# Altium project iot-gateway.PrjPcb (part 1 of 2)
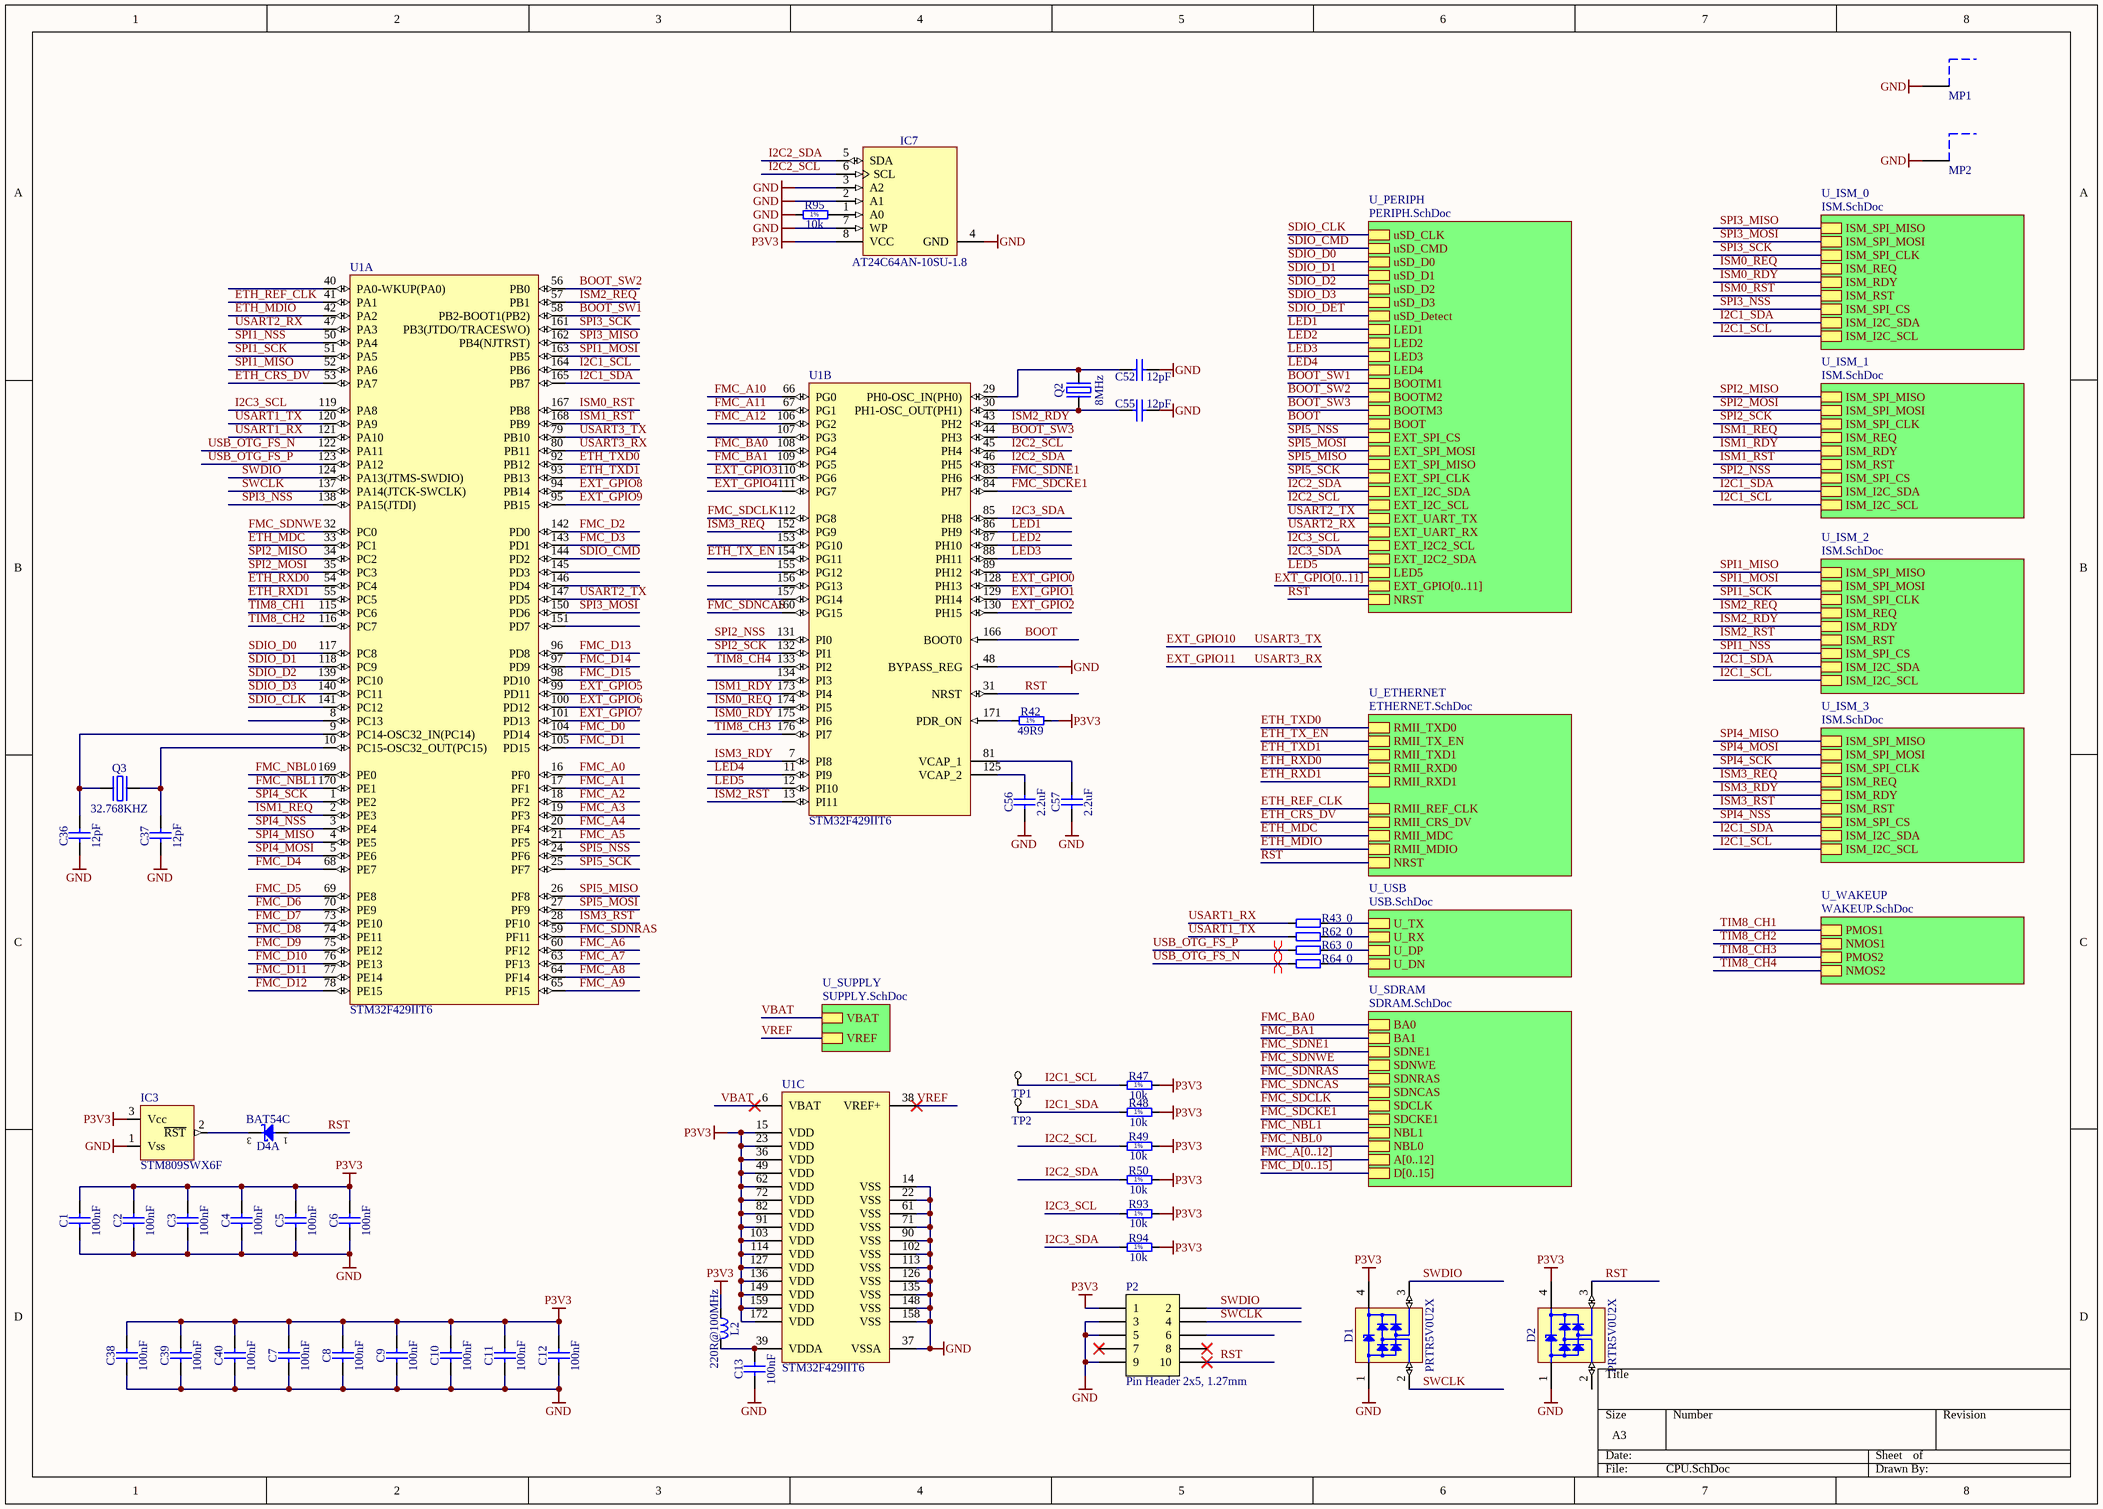
[diagram p0: CPU.SchDoc]
8 sheets, 359 parts. Net scope: hierarchical (ports join the sheet entries above them; power ports are global).
Board files: iot-gateway.PcbDoc, Panel.PcbDoc
Sheets:
  CPU.SchDoc
    U_SDRAM = SDRAM.SchDoc
    U_ETHERNET = ETHERNET.SchDoc
    U_PERIPH = PERIPH.SchDoc
    U_USB = USB.SchDoc
    U_SUPPLY = SUPPLY.SchDoc
    U_ISM_0 = ISM.SchDoc
    U_ISM_1 = ISM.SchDoc
    U_ISM_2 = ISM.SchDoc
    U_ISM_3 = ISM.SchDoc
    U_WAKEUP = WAKEUP.SchDoc

## Sheet CPU.SchDoc
size A3

### Parts
(Parts that share a designator on the sheet are numbered #1, #2 ... from top to bottom, then left to right.)
C1  100nF  [CAPC1005X55N]
C2  100nF  [CAPC1005X55N]
C3  100nF  [CAPC1005X55N]
C4  100nF  [CAPC1005X55N]
C5  100nF  [CAPC1005X55N]
C6  100nF  [CAPC1005X55N]
C7  100nF  [CAPC1005X55N]
C8  100nF  [CAPC1005X55N]
C9  100nF  [CAPC1005X55N]
C10  100nF  [CAPC1005X55N]
C11  100nF  [CAPC1005X55N]
C12  100nF  [CAPC1005X55N]
C13  100nF  [CAPC1005X55N]
C36#1  12pF  [CAPC1005X55N]
C37#1  12pF  [CAPC1005X55N]
C38#1  100nF  [CAPC1005X55N]
C39#1  100nF  [CAPC1005X55N]
C40#1  100nF  [CAPC1005X55N]
C52  12pF  [CAPC1005X55N]
C55  12pF  [CAPC1005X55N]
C56  2.2uF  [CAPC1608X87N]
C57  2.2uF  [CAPC1608X87N]
D1  PRTR5V0U2X  [SOT190P230X110-4N]
D2#1  PRTR5V0U2X  [SOT190P230X110-4N]
D4  BAT54C  [SOT95P240X130-3N]  (part A of 2)
IC3  STM809SWX6F  [SOT95P229X119-3N]
IC7  AT24C64AN-10SU-1.8  [SOIC127P600X175-8N]
L2  220R@100MHz  [INDC2012X105N]
MP1  36103205S  [36103205S]  (value not drawn)
MP2  36103205S  [36103205S]  (value not drawn)
P2  Pin Header 2x5, 1.27mm  [HDR_2x5-SMD-1.27mm-K]
Q2  8MHz  [XTAL_TXC_7A]
Q3  32.768KHZ  [XTAL_ABRACON_ABS09]
R42  49R9  [RESC1005X40N]
R43  0  [RESC1005X40N]
R47  10k  [RESC1005X40N]
R48  10k  [RESC1005X40N]
R49  10k  [RESC1005X40N]
R50  10k  [RESC1005X40N]
R62  0  [RESC1005X40N]
R63  0  [RESC1005X40N]
R64  0  [RESC1005X40N]
R93  10k  [RESC1005X40N]
R94  10k  [RESC1005X40N]
R95  10k  [RESC1005X40N]
TP1#1  TP  [TP]  (value not drawn)  (no BOM)
TP2#1  TP  [TP]  (value not drawn)  (no BOM)
U1  STM32F429IIT6  [STM-LQFP176_N]  (parts A,B,C of 3)

### Sub-sheets
U_ETHERNET = ETHERNET.SchDoc: RMII_TXD0, RMII_TX_EN, RMII_TXD1, RMII_RXD0, RMII_RXD1, RMII_REF_CLK, RMII_CRS_DV, RMII_MDC, RMII_MDIO, NRST
U_ISM_0 = ISM.SchDoc: ISM_SPI_MISO, ISM_SPI_MOSI, ISM_SPI_CLK, ISM_REQ, ISM_RDY, ISM_RST, ISM_SPI_CS, ISM_I2C_SDA, ISM_I2C_SCL
U_ISM_1 = ISM.SchDoc: ISM_SPI_MISO, ISM_SPI_MOSI, ISM_SPI_CLK, ISM_REQ, ISM_RDY, ISM_RST, ISM_SPI_CS, ISM_I2C_SDA, ISM_I2C_SCL
U_ISM_2 = ISM.SchDoc: ISM_SPI_MISO, ISM_SPI_MOSI, ISM_SPI_CLK, ISM_REQ, ISM_RDY, ISM_RST, ISM_SPI_CS, ISM_I2C_SDA, ISM_I2C_SCL
U_ISM_3 = ISM.SchDoc: ISM_SPI_MISO, ISM_SPI_MOSI, ISM_SPI_CLK, ISM_REQ, ISM_RDY, ISM_RST, ISM_SPI_CS, ISM_I2C_SDA, ISM_I2C_SCL
U_PERIPH = PERIPH.SchDoc: uSD_CLK, uSD_CMD, uSD_D0, uSD_D1, uSD_D2, uSD_D3, uSD_Detect, LED1, LED2, LED3, LED4, BOOTM1, BOOTM2, BOOTM3, BOOT, EXT_SPI_CS, EXT_SPI_MOSI, EXT_SPI_MISO, EXT_SPI_CLK, EXT_I2C_SDA, EXT_I2C_SCL, EXT_UART_TX, EXT_UART_RX, LED5, EXT_GPIO[0..11], EXT_I2C2_SCL, EXT_I2C2_SDA, NRST
U_SDRAM = SDRAM.SchDoc: BA0, BA1, SDNE1, SDNWE, SDNRAS, SDNCAS, SDCLK, SDCKE1, NBL1, NBL0, A[0..12], D[0..15]
U_SUPPLY = SUPPLY.SchDoc: VBAT, VREF
U_USB = USB.SchDoc: U_TX, U_RX, U_DP, U_DN
U_WAKEUP = WAKEUP.SchDoc: PMOS1, NMOS1, PMOS2, NMOS2

### Nets
GND: C1.1 C2.1 C3.1 C4.1 C5.1 C6.1 C7.1 C8.1 C9.1 C10.1 C11.1 C12.1 C13.1 C36#1.1 C37#1.1 C38#1.1 C39#1.1 C40#1.1 C52.1 C55.1 C56.1 C57.1 D1.1(GND) D2#1.1(GND) IC3.1(Vss) IC7.2(A1) IC7.3(A2) IC7.4(GND) IC7.7(WP) MP1.1 MP2.1 P2.3 P2.5 P2.9 R95.1 U1.14(VSS) U1.22(VSS) U1.37(VSSA) U1.48(BYPASS_REG) U1.61(VSS) U1.71(VSS) U1.90(VSS) U1.102(VSS) U1.113(VSS) U1.126(VSS) U1.135(VSS) U1.148(VSS) U1.158(VSS)
P3V3: C1.2 C2.2 C3.2 C4.2 C5.2 C6.2 C7.2 C8.2 C9.2 C10.2 C11.2 C12.2 C38#1.2 C39#1.2 C40#1.2 D1.4(VCC) D2#1.4(VCC) IC3.3(Vcc) IC7.8(VCC) L2.1 P2.1 R42.2 R47.2 R48.2 R49.2 R50.2 R93.2 R94.2 U1.15(VDD) U1.23(VDD) U1.36(VDD) U1.49(VDD) U1.62(VDD) U1.72(VDD) U1.82(VDD) U1.91(VDD) U1.103(VDD) U1.114(VDD) U1.127(VDD) U1.136(VDD) U1.149(VDD) U1.159(VDD) U1.172(VDD)
VREF: U1.38(VREF+) ; sheet U_SUPPLY/VREF
BOOT: U1.166(BOOT0) ; sheet U_PERIPH/BOOT
BOOT_SW1: U1.58(PB2-BOOT1(PB2)) ; sheet U_PERIPH/BOOTM1
BOOT_SW2: U1.56(PB0) ; sheet U_PERIPH/BOOTM2
BOOT_SW3: U1.44(PH3) ; sheet U_PERIPH/BOOTM3
ETH_CRS_DV: U1.53(PA7) ; sheet U_ETHERNET/RMII_CRS_DV
ETH_MDC: U1.33(PC1) ; sheet U_ETHERNET/RMII_MDC
ETH_MDIO: U1.42(PA2) ; sheet U_ETHERNET/RMII_MDIO
ETH_REF_CLK: U1.41(PA1) ; sheet U_ETHERNET/RMII_REF_CLK
ETH_RXD0: U1.54(PC4) ; sheet U_ETHERNET/RMII_RXD0
ETH_RXD1: U1.55(PC5) ; sheet U_ETHERNET/RMII_RXD1
ETH_TX_EN: U1.154(PG11) ; sheet U_ETHERNET/RMII_TX_EN
ETH_TXD0: U1.92(PB12) ; sheet U_ETHERNET/RMII_TXD0
ETH_TXD1: U1.93(PB13) ; sheet U_ETHERNET/RMII_TXD1
EXT_GPIO0: U1.128(PH13)
EXT_GPIO1: U1.129(PH14)
EXT_GPIO2: U1.130(PH15)
EXT_GPIO3: U1.110(PG6)
EXT_GPIO4: U1.111(PG7)
EXT_GPIO5: U1.99(PD11)
EXT_GPIO6: U1.100(PD12)
EXT_GPIO7: U1.101(PD13)
EXT_GPIO8: U1.94(PB14)
EXT_GPIO9: U1.95(PB15)
EXT_GPIO10: U1.79(PB10)  [also labelled USART3_TX]
EXT_GPIO11: U1.80(PB11)  [also labelled USART3_RX]
FMC_A0: U1.16(PF0)  [project net A0]
FMC_A1: U1.17(PF1)  [project net A1]
FMC_A2: U1.18(PF2)  [project net A2]
FMC_A3: U1.19(PF3)  [project net A3]
FMC_A4: U1.20(PF4)  [project net A4]
FMC_A5: U1.21(PF5)  [project net A5]
FMC_A6: U1.60(PF12)  [project net A6]
FMC_A7: U1.63(PF13)  [project net A7]
FMC_A8: U1.64(PF14)  [project net A8]
FMC_A9: U1.65(PF15)  [project net A9]
FMC_A10: U1.66(PG0)  [project net A10]
FMC_A11: U1.67(PG1)  [project net A11]
FMC_A12: U1.106(PG2)  [project net A12]
FMC_BA0: U1.108(PG4) ; sheet U_SDRAM/BA0
FMC_BA1: U1.109(PG5) ; sheet U_SDRAM/BA1
FMC_D0: U1.104(PD14)  [project net D0]
FMC_D1: U1.105(PD15)  [project net D1]
FMC_D2: U1.142(PD0)  [project net D2]
FMC_D3: U1.143(PD1)  [project net D3]
FMC_D4: U1.68(PE7)  [project net D4]
FMC_D5: U1.69(PE8)  [project net D5]
FMC_D6: U1.70(PE9)  [project net D6]
FMC_D7: U1.73(PE10)  [project net D7]
FMC_D8: U1.74(PE11)  [project net D8]
FMC_D9: U1.75(PE12)  [project net D9]
FMC_D10: U1.76(PE13)  [project net D10]
FMC_D11: U1.77(PE14)  [project net D11]
FMC_D12: U1.78(PE15)  [project net D12]
FMC_D13: U1.96(PD8)  [project net D13]
FMC_D14: U1.97(PD9)  [project net D14]
FMC_D15: U1.98(PD10)  [project net D15]
FMC_NBL0: U1.169(PE0) ; sheet U_SDRAM/NBL0
FMC_NBL1: U1.170(PE1) ; sheet U_SDRAM/NBL1
FMC_SDCKE1: U1.84(PH7) ; sheet U_SDRAM/SDCKE1
FMC_SDCLK: U1.112(PG8) ; sheet U_SDRAM/SDCLK
FMC_SDNCAS: U1.160(PG15) ; sheet U_SDRAM/SDNCAS
FMC_SDNE1: U1.83(PH6) ; sheet U_SDRAM/SDNE1
FMC_SDNRAS: U1.59(PF11) ; sheet U_SDRAM/SDNRAS
FMC_SDNWE: U1.32(PC0) ; sheet U_SDRAM/SDNWE
I2C1_SCL: R47.1 TP1#1.1 U1.164(PB6) ; sheet U_ISM_0/ISM_I2C_SCL, sheet U_ISM_1/ISM_I2C_SCL, sheet U_ISM_2/ISM_I2C_SCL, sheet U_ISM_3/ISM_I2C_SCL
I2C1_SDA: R48.1 TP2#1.1 U1.165(PB7) ; sheet U_ISM_0/ISM_I2C_SDA, sheet U_ISM_1/ISM_I2C_SDA, sheet U_ISM_2/ISM_I2C_SDA, sheet U_ISM_3/ISM_I2C_SDA
I2C2_SCL: IC7.6(SCL) R49.1 U1.45(PH4) ; sheet U_PERIPH/EXT_I2C_SCL
I2C2_SDA: IC7.5(SDA) R50.1 U1.46(PH5) ; sheet U_PERIPH/EXT_I2C_SDA
I2C3_SCL: R93.1 U1.119(PA8) ; sheet U_PERIPH/EXT_I2C2_SCL
I2C3_SDA: R94.1 U1.85(PH8) ; sheet U_PERIPH/EXT_I2C2_SDA
ISM0_RDY: U1.175(PI6) ; sheet U_ISM_0/ISM_RDY
ISM0_REQ: U1.174(PI5) ; sheet U_ISM_0/ISM_REQ
ISM0_RST: U1.167(PB8) ; sheet U_ISM_0/ISM_RST
ISM1_RDY: U1.173(PI4) ; sheet U_ISM_1/ISM_RDY
ISM1_REQ: U1.2(PE3) ; sheet U_ISM_1/ISM_REQ
ISM1_RST: U1.168(PB9) ; sheet U_ISM_1/ISM_RST
ISM2_RDY: U1.43(PH2) ; sheet U_ISM_2/ISM_RDY
ISM2_REQ: U1.57(PB1) ; sheet U_ISM_2/ISM_REQ
ISM2_RST: U1.13(PI11) ; sheet U_ISM_2/ISM_RST
ISM3_RDY: U1.7(PI8) ; sheet U_ISM_3/ISM_RDY
ISM3_REQ: U1.152(PG9) ; sheet U_ISM_3/ISM_REQ
ISM3_RST: U1.28(PF10) ; sheet U_ISM_3/ISM_RST
LED1: U1.86(PH9) ; sheet U_PERIPH/LED1
LED2: U1.87(PH10) ; sheet U_PERIPH/LED2
LED3: U1.88(PH11) ; sheet U_PERIPH/LED3
LED4: U1.11(PI9) ; sheet U_PERIPH/LED4
LED5: U1.12(PI10) ; sheet U_PERIPH/LED5
RST: D2#1.3(I/O2) D4.1(A) P2.10 U1.31(NRST) ; sheet U_ETHERNET/NRST, sheet U_PERIPH/NRST
SDIO_CLK: U1.141(PC12) ; sheet U_PERIPH/uSD_CLK
SDIO_CMD: U1.144(PD2) ; sheet U_PERIPH/uSD_CMD
SDIO_D0: U1.117(PC8) ; sheet U_PERIPH/uSD_D0
SDIO_D1: U1.118(PC9) ; sheet U_PERIPH/uSD_D1
SDIO_D2: U1.139(PC10) ; sheet U_PERIPH/uSD_D2
SDIO_D3: U1.140(PC11) ; sheet U_PERIPH/uSD_D3
SPI1_MISO: U1.52(PA6) ; sheet U_ISM_2/ISM_SPI_MISO
SPI1_MOSI: U1.163(PB5) ; sheet U_ISM_2/ISM_SPI_MOSI
SPI1_NSS: U1.50(PA4) ; sheet U_ISM_2/ISM_SPI_CS
SPI1_SCK: U1.51(PA5) ; sheet U_ISM_2/ISM_SPI_CLK
SPI2_MISO: U1.34(PC2) ; sheet U_ISM_1/ISM_SPI_MISO
SPI2_MOSI: U1.35(PC3) ; sheet U_ISM_1/ISM_SPI_MOSI
SPI2_NSS: U1.131(PI0) ; sheet U_ISM_1/ISM_SPI_CS
SPI2_SCK: U1.132(PI1) ; sheet U_ISM_1/ISM_SPI_CLK
SPI3_MISO: U1.162(PB4(NJTRST)) ; sheet U_ISM_0/ISM_SPI_MISO
SPI3_MOSI: U1.150(PD6) ; sheet U_ISM_0/ISM_SPI_MOSI
SPI3_NSS: U1.138(PA15(JTDI)) ; sheet U_ISM_0/ISM_SPI_CS
SPI3_SCK: U1.161(PB3(JTDO/TRACESWO)) ; sheet U_ISM_0/ISM_SPI_CLK
SPI4_MISO: U1.4(PE5) ; sheet U_ISM_3/ISM_SPI_MISO
SPI4_MOSI: U1.5(PE6) ; sheet U_ISM_3/ISM_SPI_MOSI
SPI4_NSS: U1.3(PE4) ; sheet U_ISM_3/ISM_SPI_CS
SPI4_SCK: U1.1(PE2) ; sheet U_ISM_3/ISM_SPI_CLK
SPI5_MISO: U1.26(PF8) ; sheet U_PERIPH/EXT_SPI_MISO
SPI5_MOSI: U1.27(PF9) ; sheet U_PERIPH/EXT_SPI_MOSI
SPI5_NSS: U1.24(PF6) ; sheet U_PERIPH/EXT_SPI_CS
SPI5_SCK: U1.25(PF7) ; sheet U_PERIPH/EXT_SPI_CLK
SWCLK: D1.2(I/O1) P2.4 U1.137(PA14(JTCK-SWCLK))
SWDIO: D1.3(I/O2) P2.2 U1.124(PA13(JTMS-SWDIO))
TIM8_CH1: U1.115(PC6) ; sheet U_WAKEUP/PMOS1
TIM8_CH2: U1.116(PC7) ; sheet U_WAKEUP/NMOS1
TIM8_CH3: U1.176(PI7) ; sheet U_WAKEUP/PMOS2
TIM8_CH4: U1.133(PI2) ; sheet U_WAKEUP/NMOS2
U_N: R64.1 ; sheet U_USB/U_DN
U_P: R63.2 ; sheet U_USB/U_DP
USART1_RX: R43.1 U1.121(PA10)
USART1_TX: R62.2 U1.120(PA9)
USART2_RX: U1.47(PA3) ; sheet U_PERIPH/EXT_UART_RX
USART2_TX: U1.147(PD5) ; sheet U_PERIPH/EXT_UART_TX
USB_OTG_FS_N: R64.2 U1.122(PA11)
USB_OTG_FS_P: R63.1 U1.123(PA12)
VBAT: U1.6(VBAT) ; sheet U_SUPPLY/VBAT
NetC13_2: C13.2 L2.2 U1.39(VDDA)
NetC36#1_2: C36#1.2 Q3.1(OSC1) U1.9(PC14-OSC32_IN(PC14))
NetC37#1_2: C37#1.2 Q3.2(OSC2) U1.10(PC15-OSC32_OUT(PC15))
NetC52_2: C52.2 Q2.2(OSC2) U1.29(PH0-OSC_IN(PH0))
NetC55_2: C55.2 Q2.1(OSC1) U1.30(PH1-OSC_OUT(PH1))
NetC56_2: C56.2 U1.125(VCAP_2)
NetC57_2: C57.2 U1.81(VCAP_1)
NetD4_3: D4.3(COMC) IC3.2(~{RST})
NetIC7_1: IC7.1(A0) R95.2
NetR42_1: R42.1 U1.171(PDR_ON)
NetR43_2: R43.2 ; sheet U_USB/U_TX
NetR62_1: R62.1 ; sheet U_USB/U_RX

Not connected (* = marked no-connect by the designer): D2#1 2(I/O1); P2 6 7* 8*; U1 8(PC13) 40(PA0-WKUP(PA0)) 89(PH12) 107(PG3) 134(PI3) 145(PD3) 146(PD4) 151(PD7) 153(PG10) 155(PG12) 156(PG13) 157(PG14)

### Buses and harness runs
bus EXT_GPIO[0..11] = sheet U_PERIPH/EXT_GPIO[0..11]
bus FMC_A[0..12] = sheet U_SDRAM/A[0..12]
bus FMC_D[0..15] = sheet U_SDRAM/D[0..15]

### Layout directives
differential pair: USB_OTG_FS_N, USB_OTG_FS_P

### Notes on the sheet
- (in symbol R0402_10K_1%_0.0625W_100PPM) 1%
- (in symbol R0402_49R9_1%_0.0625W_100PPM) 1%

### Library data of the parts
C1-C13 C38#1 C39#1 C40#1 = CC0402_100NF_16V_10%_X5R: Non-polarised capacitor; Part Description: SMD Multilayer Chip Ceramic Capacitor; Manufacturer: GENERIC; Manufacturer1 Part Number: GRM155R61C104KA88D; Voltage: 16V; TC: X5R; Tolerance: ±10%; Part Number: CC0402_100NF_16V_10%_X5R; Component Kind: Standard; Component Type: Standard; Pin Count: 2; Value: 100nF; Status: None; Manufacturer Part Number: CC0402_100NF_16V_10%_X5R; Case: 0402; Mounted: Yes; Socket: No; SMD: Yes; Sense: No; Manufacturer1 Example: MURATA; Manufacturer1 ComponentHeight: 0.55mm; HelpURL: \\cern.ch\dfs\Applications\Altium\Datasheets\CC0402_X5R_MURATA_GRM.pdf; Author: CERN DEM JLC; CreateDate: 2013-12-10; LatestRevisionDate: 2013-12-10
C36#1 C37#1 C52 C55 = CC0402_12PF_50V_5%_C0G: Non-polarised capacitor; Part Description: SMD Multilayer Chip Ceramic Capacitor; Manufacturer: GENERIC; Manufacturer1 Part Number: C0402C120J5GACTU; Voltage: 50V; TC: C0G/NP0; Tolerance: ±5%; Part Number: CC0402_12PF_50V_5%_C0G; Component Kind: Standard; Component Type: Standard; Pin Count: 2; Value: 12pF; Status: Preferred; Manufacturer Part Number: CC0402_12PF_50V_5%_C0G; Case: 0402; Mounted: Yes; Socket: No; SMD: Yes; Sense: No; Manufacturer1 Example: KEMET; Manufacturer1 ComponentHeight: 0.55mm; HelpURL: \\cern.ch\dfs\Applications\Altium\Datasheets\CC0805_C0G_KEMET_(Commercial Grade).pdf; Author: CERN DEM JLC; CreateDate: 2016-10-04; LatestRevisionDate: 2016-10-04
C56 C57 = CC0603_2.2UF_16V_10%_X5R: Non-polarised capacitor; Part Description: SMD Multilayer Chip Ceramic Capacitor; Manufacturer: GENERIC; Manufacturer1 Part Number: CC0603KRX5R7BB225; Voltage: 16V; TC: X5R; Tolerance: ±10%; Part Number: CC0603_2.2UF_16V_10%_X5R; Component Kind: Standard; Component Type: Standard; Pin Count: 2; Value: 2.2uF; Status: Preferred; Manufacturer Part Number: CC0603_2.2UF_16V_10%_X5R; Case: 0603; Mounted: Yes; Socket: No; SMD: Yes; Sense: No; Manufacturer1 Example: YAGEO; Manufacturer1 ComponentHeight: 0.9mm; HelpURL: \\cern.ch\dfs\Applications\Altium\Datasheets\CC0805_X5R_PHYCOMP_HC.pdf; Author: CERN DEM JLC; CreateDate: 2011-04-28; LatestRevisionDate: 2011-04-28
D1 D2#1 = PRTR5V0U2X: Ultra Low Capacitance Double Rail-to-Rail ESD Protection Diode; Part Description: Ultra Low Capacitance (1pF) Double Rail-to-Rail ESD Protection Diode (8kV); Manufacturer: NXP SEMICONDUCTORS; Voltage: 5.5V; PressFit: No; Bonding: No; Part Number: PRTR5V0U2X; Component Kind: Standard; Component Type: Standard; Device: PRTR5V0U2X; PackageDescription: SOT143B, SOT, 1.90mm Pitch; 4 Pin, 1.30mm W X 2.90mm L X 1.10mm H body, IPC Medium Density; Manufacturer Part Number: PRTR5V0U2X; Pin Count: 4; Case: SOT143B; Mounted: Yes; Socket: No; SMD: Yes; Sense: No; ComponentHeight: 1.1mm; HelpURL: \\cern.ch\dfs\Applications\Altium\Datasheets\PRTR5V0U2X.pdf; Author: CERN DEM JLC; CreateDate: 22.03.2011; LatestRevisionDate: 22.03.2011
D4 = BAT54C: Dual Common Cathode Schottky Diodes; Part Description: Dual Common Cathode Small Signal Schottky Diode; Manufacturer: FAIRCHILD SEMICONDUCTOR; Voltage: 30V; Power: 200mA; PressFit: No; Bonding: No; Part Number: BAT54C; Component Kind: Standard; Component Type: Standard; Device: BAT54C; PackageDescription: SOT23 3-Leads, Pitch 0.95mm - Body 1.3x2.9mm, IPC Medium Density; Manufacturer Part Number: BAT54C; Pin Count: 3; Case: SOT23-3; Mounted: Yes; Socket: No; SMD: Yes; Sense: No; ComponentHeight: 1.30mm; HelpURL: \\cern.ch\dfs\Applications\Altium\Datasheets\BAT54C.pdf; Author: CERN DEM JLC; CreateDate: 2009-09-17; LatestRevisionDate: 2010-05-27
IC3 = VMON_STM809: 2.93V  Reset circuit
IC7 = AT24C64AN-10SU-1.8: 64K (8192 x 8), Two-Wire Serial EEPROM; Part Description: 1.8V, 64K (8192 x 8), Two-Wire Serial EEPROM; Manufacturer: ATMEL; PressFit: No; Bonding: No; Part Number: AT24C64AN-10SU-1.8; Component Kind: Standard; Component Type: Standard; Device: AT24C64AN-10SU-1.8; PackageDescription: SOIC 8, Pitch 1.27mm - Body 4x5mm, IPC Medium Density; Status: Obsolete; Manufacturer Part Number: AT24C64AN-10SU-1.8; Pin Count: 8; Case: SOIC8; Mounted: Yes; Socket: No; SMD: Yes; Sense: No; ComponentHeight: 1.75mm; HelpURL: \\cern.ch\dfs\Applications\Altium\Datasheets\AT24C64AN-10SU-1.8.pdf; Author: CERN DEM JLC; CreateDate: 2013-11-26; LatestRevisionDate: 2013-11-26
L2 = IND0805_MURATA_BLM21PG221SN1D: Inductor; Part Description: SMD EMIFIL Suppression Chip Ferrite Bead; Manufacturer: MURATA; Power: 2A; Resistance: 0.05R; Tolerance: ±25%; Part Number: IND0805_MURATA_BLM21PG221SN1D; Component Kind: Standard; Component Type: Standard; Pin Count: 2; Value: 220R@100MHz; Status: None; Manufacturer Part Number: BLM21PG221SN1D; Case: 0805; Mounted: Yes; Socket: No; SMD: Yes; Sense: No; ComponentHeight: 1.05mm; HelpURL: \\cern.ch\dfs\Applications\Altium\Datasheets\IND0402_MURATA_BLM21P.pdf; Author: CERN DEM JLC; CreateDate: 2010-01-25; LatestRevisionDate: 2010-01-25
MP1 MP2 = 36103205S: WE-SHC Shielding Cabinet, SMD Frame, 20 x 20 x 3 mm; Published Date: April 2017; Publisher: Wurth Elektronik; ComponentLink1Description: Manufacturer; ComponentLink1URL: http://www.we-online.de; ComponentLink2Description: Datasheet; ComponentLink2URL: http://katalog.we-online.de/pbs/datasheet/36103205S.pdf; Part Number: 36103205S; Type: SMD Frame; Size: 20 x 20 x 3 mm
P2 = Pin Header 2x5 SMD, 1.27mm, KS: Pin Header 2x5, 1.27mm (50mil), SMD, Keying Shroud; Manufacturer: WCON; Manufacturer Part Number: 3132-10MS0BK00R1; 2nd source part number: FTSH-105-01-F-DV-K; Artikkelnr Noca: 55010009; Artikkelnr Simpro: N.A.; Part Number: Pin Header 2x5 SMD, 1.27mm, KS; Datasheet: \\hizz\pro\app9717\Datasheet\connectores\W-CON\3132-XXMXXBK00XX.pdf; Footprint Doc: HDR_2x5-SMD-1.27mm; LatestRevisionDate: 2016-04-21; Pin Count: 10; Publisher: Nordic Semiconductor; Published: 2016-01-22; Value: Pin Header 2x5, 1.27mm; Note: *; Supplier: Cabcon; Supplier part number: 3132-10MS0BK00R1; 2nd source Supplier: Samtec
Q2 = XTAL_8MHZ_TXC_7A-8.000MAAE-T: Quartz Crystal; Part Description: Tolerance: ±30ppm, Stability: ±30ppm, -20°C to +70°C, 12pF, SMD Glass Seam Sealing Crystal, 7A Series; Manufacturer: TXC CORPORATION; PressFit: No; Bonding: No; Part Number: XTAL_8MHZ_TXC_7A-8.000MAAE-T; Component Kind: Standard; Component Type: Standard; PackageDescription: 2 Pins, 3.2x5mm, SMD Glass Seam Sealing Crystal, 7A Serie; Value: 8MHz; Manufacturer Part Number: 7A-8.000MAAE-T; Pin Count: 2; Mounted: Yes; Socket: No; SMD: Yes; Sense: No; ComponentHeight: 1.2mm; HelpURL: \\cern.ch\dfs\Applications\Altium\Datasheets\XTAL_TXC_7A.pdf; Author: CERN DEM JLC; CreateDate: 09.10.2014; LatestRevisionDate: 12.11.2014
Q3 = XTAL_32.768KHZ_ABRACON_ABS09-32.768KHZ-T: Quartz Crystal; Part Description: Tolerance: ±20ppm, Stability: ±5ppm, -40°C to +85°C, 12.5pF, SMD Low Profile Crystal, ABS09 Series; PressFit: No; Bonding: No; Part Number: XTAL_32.768KHZ_ABRACON_ABS09-32.768KHZ-T; Component Kind: Standard; Component Type: Standard; PackageDescription: 2 Pins, 4.1x1.5mm, SMD Low Profile Crystal, ABS09 Serie; Value: 32.768KHZ; Manufacturer: ABRACON; Manufacturer Part Number: ABS09-32.768KHZ-T; Pin Count: 2; Mounted: Yes; Socket: No; SMD: Yes; Sense: No; ComponentHeight: 0.9mm; HelpURL: \\cern.ch\dfs\Applications\Altium\Datasheets\XTAL_ABRACON_ABS09.pdf; Author: CERN DEM JLC; CreateDate: 2014-10-16; LatestRevisionDate: 2014-10-16
R42 = R0402_49R9_1%_0.0625W_100PPM: Resistor - 1%; Part Description: General Purpose Thick Film Chip Resistor; Manufacturer: GENERIC; Manufacturer1 Part Number: 232270674999L or RC0402FR-0749R9L; TC: ±100ppm/°C; Part Number: R0402_49R9_1%_0.0625W_100PPM; Component Kind: Standard; Component Type: Standard; Pin Count: 2; Value: 49R9; Status: Not recommended; Power: 0.0625W; Tolerance: ±1%; Manufacturer Part Number: R0402_49R9_1%_0.0625W_100PPM; Case: 0402; Mounted: Yes; Sense: No; Socket: No; SMD: Yes; Manufacturer1 Example: YAGEO PHYCOMP; Manufacturer1 ComponentHeight: 0.4mm; HelpURL: \\cern.ch\dfs\Applications\Altium\Datasheets\R0402_Phycomp_RC0402.pdf; Author: CERN DEM JLC; CreateDate: 2012-10-24; LatestRevisionDate: 2012-10-24
R43 R62-R64 = R0402_0R_JUMPER: Resistor; Part Description: 1A (0.05R Max DC Resistance) Zero Ohm Jumper; Manufacturer: GENERIC; Manufacturer1 Part Number: 232270591001L; Part Number: R0402_0R_JUMPER; Component Kind: Standard; Component Type: Standard; Pin Count: 2; Value: 0; Status: Not recommended; Manufacturer Part Number: R0402_0R_JUMPER; Case: 0402; Mounted: Yes; Sense: No; Socket: No; SMD: Yes; Manufacturer1 Example: YAGEO PHYCOMP; Manufacturer1 ComponentHeight: 0.4mm; HelpURL: \\cern.ch\dfs\Applications\Altium\Datasheets\R0402_Phycomp_RC0402.pdf; Author: CERN DEM JLC; CreateDate: 2007-12-03; LatestRevisionDate: 2012-10-17
R47-R50 R93-R95 = R0402_10K_1%_0.0625W_100PPM: Resistor - 1%; Part Description: General Purpose Thick Film Chip Resistor; Manufacturer: GENERIC; Manufacturer1 Part Number: 232270671003L; TC: ±100ppm/°C; Part Number: R0402_10K_1%_0.0625W_100PPM; Component Kind: Standard; Component Type: Standard; Pin Count: 2; Value: 10k; Status: Not recommended; Power: 0.0625W; Tolerance: ±1%; Manufacturer Part Number: R0402_10K_1%_0.0625W_100PPM; Case: 0402; Mounted: Yes; Sense: No; Socket: No; SMD: Yes; Manufacturer1 Example: YAGEO PHYCOMP; Manufacturer1 ComponentHeight: 0.4mm; HelpURL: \\cern.ch\dfs\Applications\Altium\Datasheets\R0402_Phycomp_RC0402.pdf; Author: CERN DEM JLC; CreateDate: 2007-12-03; LatestRevisionDate: 2012-10-17
TP1#1 TP2#1 = TP: Testpoint
U1 = STM32F429IIT6: ARM Cortex-M4 32-bit MCU+FPU, 225 DMIPS, 2048 kB Flash, 256 kB Internal RAM, 140 I/Os, 176-pin LQFP, -40 to 85 degC, Tray; Manufacturer: STMicroelectronics; D/A Converter: 2x12-bit; FLASH Size (Prog) (kB): 2048; I/Os (High Current): 140; Internal RAM Size (kB): 256; Operating Frequency(F) (Processor speed) (MHz): 180; Supply Voltage(Vcc) max (V): 3.6; Supply Voltage(Vcc) min (V): 1.8; DatasheetVersion: Rev. 2; PackageVersion: Rev. 4, 06/2013; PackageReference: LQFP176; PackageDescription: 176-Pin Low Profile Quad Flat Package, 24 x 24 mm Body, 0.5 mm Pitch; Supplier 1: Digi-Key; Supplier Part Number 1: 497-14054-ND; Supplier 2: Newark; Supplier Part Number 2: 06X3672; Supplier 3: Mouser; Supplier Part Number 3: 511-STM32F429IIT6; Core: ARM Cortex-M4; Packing: Tray; Mounting Technology: Surface Mount; PartNumber: STM32F429IIT6; ComponentLink1Description: Manufacturer URL; ComponentLink1URL: http://www.st.com/web/en/home.html; ComponentLink2Description: Datasheet; ComponentLink2URL: http://www.st.com/st-web-ui/static/active/en/resource/technical/document/data_brief/DM00053488.pdf; ComponentLink3Description: Package Specification; ComponentLink3URL: http://www.st.com/st-web-ui/static/active/en/resource/technical/document/datasheet/DM00035129.pdf

## Sheet SDRAM.SchDoc
size A4
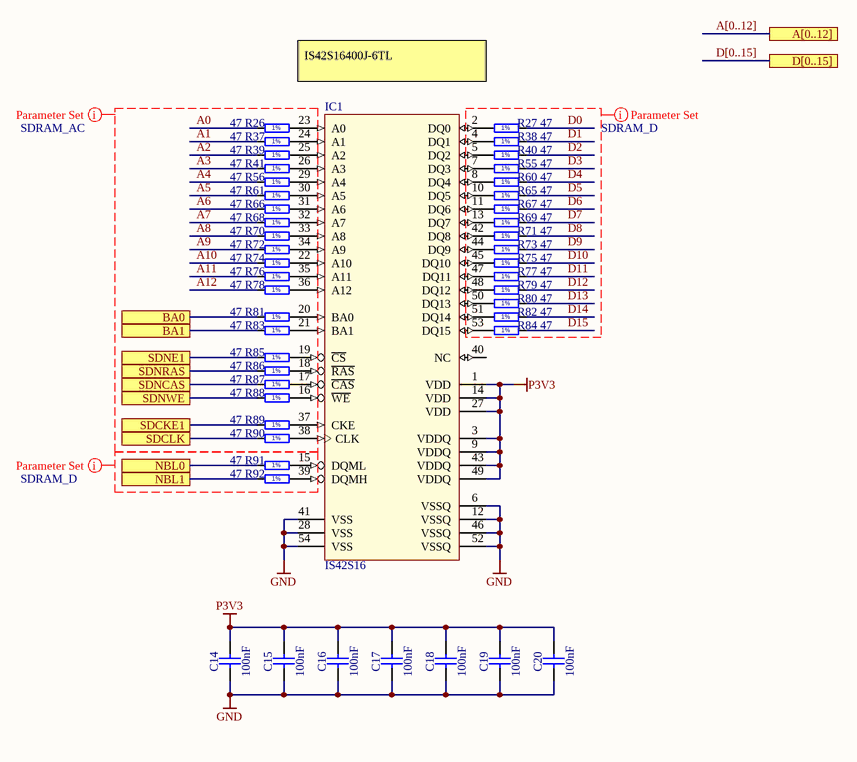
[diagram p1: SDRAM.SchDoc]

### Parts
C14  100nF  [CAPC1005X55N]
C15  100nF  [CAPC1005X55N]
C16  100nF  [CAPC1005X55N]
C17  100nF  [CAPC1005X55N]
C18  100nF  [CAPC1005X55N]
C19  100nF  [CAPC1005X55N]
C20  100nF  [CAPC1005X55N]
IC1  IS42S16  [TSOP-54]
R26  47  [RESC1005X40N]
R27  47  [RESC1005X40N]
R37  47  [RESC1005X40N]
R38  47  [RESC1005X40N]
R39  47  [RESC1005X40N]
R40  47  [RESC1005X40N]
R41  47  [RESC1005X40N]
R55  47  [RESC1005X40N]
R56  47  [RESC1005X40N]
R60  47  [RESC1005X40N]
R61  47  [RESC1005X40N]
R65  47  [RESC1005X40N]
R66  47  [RESC1005X40N]
R67  47  [RESC1005X40N]
R68  47  [RESC1005X40N]
R69  47  [RESC1005X40N]
R70  47  [RESC1005X40N]
R71  47  [RESC1005X40N]
R72  47  [RESC1005X40N]
R73  47  [RESC1005X40N]
R74  47  [RESC1005X40N]
R75  47  [RESC1005X40N]
R76  47  [RESC1005X40N]
R77  47  [RESC1005X40N]
R78  47  [RESC1005X40N]
R79  47  [RESC1005X40N]
R80  47  [RESC1005X40N]
R81  47  [RESC1005X40N]
R82  47  [RESC1005X40N]
R83  47  [RESC1005X40N]
R84  47  [RESC1005X40N]
R85  47  [RESC1005X40N]
R86  47  [RESC1005X40N]
R87  47  [RESC1005X40N]
R88  47  [RESC1005X40N]
R89  47  [RESC1005X40N]
R90  47  [RESC1005X40N]
R91  47  [RESC1005X40N]
R92  47  [RESC1005X40N]

### Ports
A[0..12], BA0, BA1, D[0..15], NBL0, NBL1, SDCKE1, SDCLK, SDNCAS, SDNE1, SDNRAS, SDNWE

### Nets
GND: C14.1 C15.1 C16.1 C17.1 C18.1 C19.1 C20.1 IC1.6(VSSQ) IC1.12(VSSQ) IC1.28(VSS) IC1.41(VSS) IC1.46(VSSQ) IC1.52(VSSQ) IC1.54(VSS)
P3V3: C14.2 C15.2 C16.2 C17.2 C18.2 C19.2 C20.2 IC1.1(VDD) IC1.3(VDDQ) IC1.9(VDDQ) IC1.14(VDD) IC1.27(VDD) IC1.43(VDDQ) IC1.49(VDDQ)
A0: R26.2
A1: R37.2
A2: R39.2
A3: R41.2
A4: R56.2
A5: R61.2
A6: R66.2
A7: R68.2
A8: R70.2
A9: R72.2
A10: R74.2
A11: R76.2
A12: R78.2
D0: R27.2
D1: R38.2
D2: R40.2
D3: R55.2
D4: R60.2
D5: R65.2
D6: R67.2
D7: R69.2
D8: R71.2
D9: R73.2
D10: R75.2
D11: R77.2
D12: R79.2
D13: R80.2
D14: R82.2
D15: R84.2
FMC_BA0: R81.2 ; port BA0
FMC_BA1: R83.2 ; port BA1
FMC_NBL0: R91.2 ; port NBL0
FMC_NBL1: R92.2 ; port NBL1
FMC_SDCKE1: R89.2 ; port SDCKE1
FMC_SDCLK: R90.2 ; port SDCLK
FMC_SDNCAS: R87.2 ; port SDNCAS
FMC_SDNE1: R85.2 ; port SDNE1
FMC_SDNRAS: R86.2 ; port SDNRAS
FMC_SDNWE: R88.2 ; port SDNWE
NetIC1_2: IC1.2(DQ0) R27.1
NetIC1_4: IC1.4(DQ1) R38.1
NetIC1_5: IC1.5(DQ2) R40.1
NetIC1_7: IC1.7(DQ3) R55.1
NetIC1_8: IC1.8(DQ4) R60.1
NetIC1_10: IC1.10(DQ5) R65.1
NetIC1_11: IC1.11(DQ6) R67.1
NetIC1_13: IC1.13(DQ7) R69.1
NetIC1_15: IC1.15(DQML) R91.1
NetIC1_16: IC1.16(~{WE}) R88.1
NetIC1_17: IC1.17(~{CAS}) R87.1
NetIC1_18: IC1.18(~{RAS}) R86.1
NetIC1_19: IC1.19(~{CS}) R85.1
NetIC1_20: IC1.20(BA0) R81.1
NetIC1_21: IC1.21(BA1) R83.1
NetIC1_22: IC1.22(A10) R74.1
NetIC1_23: IC1.23(A0) R26.1
NetIC1_24: IC1.24(A1) R37.1
NetIC1_25: IC1.25(A2) R39.1
NetIC1_26: IC1.26(A3) R41.1
NetIC1_29: IC1.29(A4) R56.1
NetIC1_30: IC1.30(A5) R61.1
NetIC1_31: IC1.31(A6) R66.1
NetIC1_32: IC1.32(A7) R68.1
NetIC1_33: IC1.33(A8) R70.1
NetIC1_34: IC1.34(A9) R72.1
NetIC1_35: IC1.35(A11) R76.1
NetIC1_36: IC1.36(A12) R78.1
NetIC1_37: IC1.37(CKE) R89.1
NetIC1_38: IC1.38(CLK) R90.1
NetIC1_39: IC1.39(DQMH) R92.1
NetIC1_42: IC1.42(DQ8) R71.1
NetIC1_44: IC1.44(DQ9) R73.1
NetIC1_45: IC1.45(DQ10) R75.1
NetIC1_47: IC1.47(DQ11) R77.1
NetIC1_48: IC1.48(DQ12) R79.1
NetIC1_50: IC1.50(DQ13) R80.1
NetIC1_51: IC1.51(DQ14) R82.1
NetIC1_53: IC1.53(DQ15) R84.1

Not connected (* = marked no-connect by the designer): IC1 40(NC)

### Buses and harness runs
bus A[0..12] = port A[0..12]
bus D[0..15] = port D[0..15]

### Layout directives
net class SDRAM_AC: A0, A1, A2, A3, A4, A5, A6, A7, A8, A9, A10, A11, A12
net class SDRAM_D: (no net found under the mark), D0, D1, D2, D3, D4, D5, D6, D7, D8, D9, D10, D11, D12, D13, D14, D15

### Notes on the sheet
- IS42S16400J-6TL
- (in symbol R0402_47R_1%_0.0625W_100PPM) 1%

### Library data of the parts
C14-C20 = CC0402_100NF_16V_10%_X5R: as C1 on sheet CPU; Part Number: CC0402_100NF_16V_10%_X5R; Component Kind: Standard; Component Type: Standard; Pin Count: 2; Value: 100nF; Status: None; Manufacturer Part Number: CC0402_100NF_16V_10%_X5R; Case: 0402; Mounted: Yes; Socket: No; SMD: Yes; Sense: No; Manufacturer1 Example: MURATA; Manufacturer1 ComponentHeight: 0.55mm; HelpURL: \\cern.ch\dfs\Applications\Altium\Datasheets\CC0402_X5R_MURATA_GRM.pdf; Author: CERN DEM JLC; CreateDate: 2013-12-10; LatestRevisionDate: 2013-12-10
IC1 = IS42S16: SDRAM 64m 200mhz 54tsop; MP: IS42S16400J-5TL-TR; MF: ISSI; Availability: Unavailable; Package: TSOP-54 ISSI; Price: 1.24 USD; Value: *
R26 R27 R37-R41 R55 R56 R60 R61 R65-R92 = R0402_47R_1%_0.0625W_100PPM: Resistor - 1%; Part Description: General Purpose Thick Film Chip Resistor; Manufacturer: GENERIC; Manufacturer1 Part Number: 232270674709L; TC: ±100ppm/°C; Part Number: R0402_47R_1%_0.0625W_100PPM; Component Kind: Standard; Component Type: Standard; Pin Count: 2; Value: 47; Status: Not recommended; Power: 0.0625W; Tolerance: ±1%; Manufacturer Part Number: R0402_47R_1%_0.0625W_100PPM; Case: 0402; Mounted: Yes; Sense: No; Socket: No; SMD: Yes; Manufacturer1 Example: YAGEO PHYCOMP; Manufacturer1 ComponentHeight: 0.4mm; HelpURL: \\cern.ch\dfs\Applications\Altium\Datasheets\R0402_Phycomp_RC0402.pdf; Author: CERN DEM JLC; CreateDate: 2007-12-03; LatestRevisionDate: 2012-10-17

## Sheet ETHERNET.SchDoc
size A4
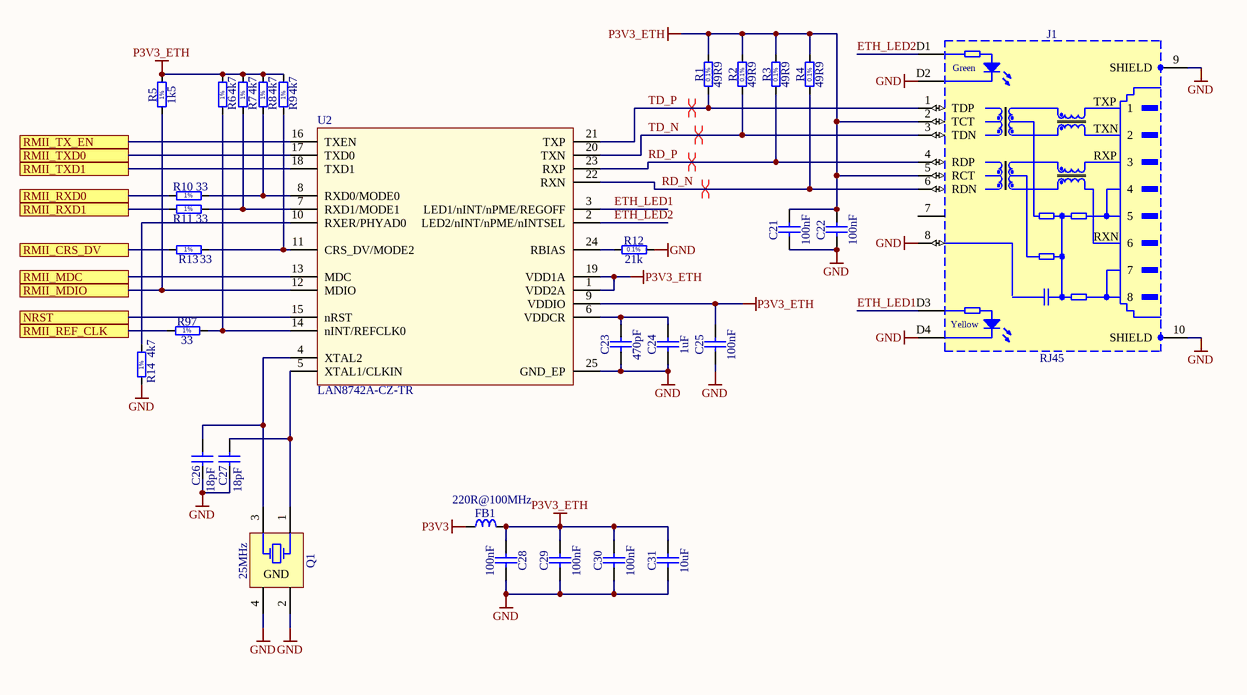
[diagram p2: ETHERNET.SchDoc]

### Parts
C21  100nF  [CAPC1005X55N]
C22  100nF  [CAPC1005X55N]
C23  470pF  [CAPC1005X55N]
C24  1uF  [CAPC1005X55N]
C25  100nF  [CAPC1005X55N]
C26  18pF  [CAPC1005X55N]
C27  18pF  [CAPC1005X55N]
C28  100nF  [CAPC1005X55N]
C29  100nF  [CAPC1005X55N]
C30  100nF  [CAPC1005X55N]
C31  10uF  [CAPC2012X135N]
FB1  220R@100MHz  [INDC2012X105N]
J1  RJ45  [TYCO_5-6605308-1]
Q1  25MHz  [XTAL_EPSON_TSX-3225]
R1  49R9  [RESC1005X35N]
R2  49R9  [RESC1005X35N]
R3  49R9  [RESC1005X35N]
R4  49R9  [RESC1005X35N]
R5  1k5  [RESC1005X40N]
R6  4k7  [RESC1005X40N]
R7  4k7  [RESC1005X40N]
R8  4k7  [RESC1005X40N]
R9  4k7  [RESC1005X40N]
R10  33  [RESC1005X40N]
R11  33  [RESC1005X40N]
R12  21k  [RESC1608X55N]
R13  33  [RESC1005X40N]
R14  4k7  [RESC1005X40N]
R97  33  [RESC1005X40N]
U2  LAN8742A-CZ-TR  [QFN50P400X400X80-25N-S225]

### Ports
NRST, RMII_CRS_DV, RMII_MDC, RMII_MDIO, RMII_REF_CLK, RMII_RXD0, RMII_RXD1, RMII_TX_EN, RMII_TXD0, RMII_TXD1

### Nets
GND: C21.1 C22.1 C23.1 C24.1 C25.1 C26.1 C27.1 C28.2 C29.1 C30.1 C31.1 J1.8 J1.9(SHIELD) J1.10(SHIELD) J1.D2 J1.D4 Q1.2(GND) Q1.4(GND) R12.2 R14.1 U2.25(GND_EP)
P3V3: FB1.1
P3V3_ETH: C21.2 C22.2 C25.2 C28.1 C29.2 C30.2 C31.2 FB1.2 J1.2(TCT) J1.5(RCT) R1.2 R2.2 R3.2 R4.2 R5.2 R6.2 R7.2 R8.2 R9.2 U2.1(VDD2A) U2.9(VDDIO) U2.19(VDD1A)
ETH_CRS_DV: R13.1 ; port RMII_CRS_DV
ETH_LED1: J1.D3 U2.3(LED1/nINT/nPME/REGOFF)
ETH_LED2: J1.D1 U2.2(LED2/nINT/nPME/nINTSEL)
ETH_MDC: U2.13(MDC) ; port RMII_MDC
ETH_MDIO: R5.1 U2.12(MDIO) ; port RMII_MDIO
ETH_REF_CLK: R97.1 ; port RMII_REF_CLK
ETH_RXD0: R10.1 ; port RMII_RXD0
ETH_RXD1: R11.1 ; port RMII_RXD1
ETH_TX_EN: U2.16(TXEN) ; port RMII_TX_EN
ETH_TXD0: U2.17(TXD0) ; port RMII_TXD0
ETH_TXD1: U2.18(TXD1) ; port RMII_TXD1
RD_N: J1.6(RDN) R4.1 U2.22(RXN)
RD_P: J1.4(RDP) R3.1 U2.23(RXP)
RST: U2.15(nRST) ; port NRST
TD_N: J1.3(TDN) R2.1 U2.20(TXN)
TD_P: J1.1(TDP) R1.1 U2.21(TXP)
NetC23_2: C23.2 C24.2 U2.6(VDDCR)
NetC26_2: C26.2 Q1.3(X) U2.4(XTAL2)
NetC27_2: C27.2 Q1.1(X) U2.5(XTAL1/CLKIN)
NetR6_1: R6.1 R97.2 U2.14(nINT/REFCLK0)
NetR7_1: R7.1 R11.2 U2.7(RXD1/MODE1)
NetR8_1: R8.1 R10.2 U2.8(RXD0/MODE0)
NetR9_1: R9.1 R13.2 U2.11(CRS_DV/MODE2)
NetR12_1: R12.1 U2.24(RBIAS)
NetR14_2: R14.2 U2.10(RXER/PHYAD0)

Not connected (* = marked no-connect by the designer): J1 7

### Layout directives
differential pair: RD_N, RD_P, TD_N, TD_P

### Notes on the sheet
- (in symbol R0402_1K5_1%_0.0625W_100PPM) 1%
- (in symbol R0402_4K7_1%_0.0625W_100PPM) 1%
- (in symbol R0402_33R_1%_0.0625W_100PPM) 1%
- (in symbol R0402_49R9_0.1%_0.063W_25PPM) 0.1%
- (in symbol R0603_21K_0.1%_0.063W_10PPM) 0.1%
- (in symbol TYCO_5-6605308-1) Green; TXP; TXN; RXP; RXN; Yellow

### Library data of the parts
C21 C22 C25 C28-C30 = CC0402_100NF_16V_10%_X5R: as C1 on sheet CPU; Part Number: CC0402_100NF_16V_10%_X5R; Component Kind: Standard; Component Type: Standard; Pin Count: 2; Value: 100nF; Status: None; Manufacturer Part Number: CC0402_100NF_16V_10%_X5R; Case: 0402; Mounted: Yes; Socket: No; SMD: Yes; Sense: No; Manufacturer1 Example: MURATA; Manufacturer1 ComponentHeight: 0.55mm; HelpURL: \\cern.ch\dfs\Applications\Altium\Datasheets\CC0402_X5R_MURATA_GRM.pdf; Author: CERN DEM JLC; CreateDate: 2013-12-10; LatestRevisionDate: 2013-12-10
C23 = CC0402_470PF_50V_10%_X7R: Non-polarised capacitor; Part Description: SMD Multilayer Chip Ceramic Capacitor; Manufacturer: GENERIC; Manufacturer1 Part Number: 223858715618; Voltage: 50V; TC: X7R; Tolerance: ±10%; Part Number: CC0402_470PF_50V_10%_X7R; Component Kind: Standard; Component Type: Standard; Pin Count: 2; Value: 470pF; Status: Not Recommended; Manufacturer Part Number: CC0402_470PF_50V_10%_X7R; Case: 0402; Mounted: Yes; Socket: No; SMD: Yes; Sense: No; Manufacturer1 Example: PHYCOMP; Manufacturer1 ComponentHeight: 0.55mm; HelpURL: \\cern.ch\dfs\Applications\Altium\Datasheets\CC0402_NP0_PHYCOMP.pdf; Author: CERN DEM JLC; CreateDate: 2007-12-03; LatestRevisionDate: 2007-12-03
C24 = CC0402_1UF_16V_10%_X5R: Non-polarised capacitor; Part Description: SMD Multilayer Chip Ceramic Capacitor; Manufacturer: GENERIC; Manufacturer1 Part Number: C1005X5R1C105KT; Voltage: 16V; TC: X5R; Tolerance: ±10%; Part Number: CC0402_1UF_16V_10%_X5R; Component Kind: Standard; Component Type: Standard; Pin Count: 2; Value: 1uF; Status: Preferred; Manufacturer Part Number: CC0402_1UF_16V_10%_X5R; Case: 0402; Mounted: Yes; Socket: No; SMD: Yes; Sense: No; Manufacturer1 Example: TDK; Manufacturer1 ComponentHeight: 0.55mm; HelpURL: \\cern.ch\dfs\Applications\Altium\Datasheets\CC0402_X5R_TDK_C.pdf; Author: CERN DEM JLC; CreateDate: 2012-10-25; LatestRevisionDate: 2012-10-25
C26 C27 = CC0402_18PF_50V_5%_C0G: Non-polarised capacitor; Part Description: SMD Multilayer Chip Ceramic Capacitor; Manufacturer: GENERIC; Manufacturer1 Part Number: C0402C180J5GACTU; Voltage: 50V; TC: C0G/NP0; Tolerance: ±5%; Part Number: CC0402_18PF_50V_5%_C0G; Component Kind: Standard; Component Type: Standard; Pin Count: 2; Value: 18pF; Status: Preferred; Manufacturer Part Number: CC0402_18PF_50V_5%_C0G; Case: 0402; Mounted: Yes; Socket: No; SMD: Yes; Sense: No; Manufacturer1 Example: KEMET; Manufacturer1 ComponentHeight: 0.55mm; HelpURL: \\cern.ch\dfs\Applications\Altium\Datasheets\CC0805_C0G_KEMET_(Commercial Grade).pdf; Author: CERN DEM JLC; CreateDate: 2016-10-04; LatestRevisionDate: 2016-10-04
C31 = CC0805_10UF_16V_10%_X5R: Non-polarised capacitor; Part Description: SMD Multilayer Chip Ceramic Capacitor; Manufacturer: GENERIC; Manufacturer1 Part Number: C0805C106K4PAC; Voltage: 16V; TC: X5R; Tolerance: ±10%; Part Number: CC0805_10UF_16V_10%_X5R; Component Kind: Standard; Component Type: Standard; Pin Count: 2; Value: 10uF; Status: Preferred; Manufacturer Part Number: CC0805_10UF_16V_10%_X5R; Case: 0805; Mounted: Yes; Socket: No; SMD: Yes; Sense: No; Manufacturer1 Example: KEMET; Manufacturer1 ComponentHeight: 1.4mm; HelpURL: \\cern.ch\dfs\Applications\Altium\Datasheets\CC1206_X5R_KEMET.pdf; Author: CERN DEM JLC; CreateDate: 2007-12-03; LatestRevisionDate: 2007-12-03
FB1 = IND0805_MURATA_BLM21PG221SN1D: Inductor; Part Description: SMD EMIFIL Suppression Chip Ferrite Bead; Manufacturer: MURATA; Power: 2A; Resistance: 0.05R; Tolerance: ±25%; Table: Inductors SMD; Part Number: IND0805_MURATA_BLM21PG221SN1D; Component Kind: Standard; Component Type: Standard; Pin Count: 2; Value: 220R@100MHz; Status: None; Manufacturer Part Number: BLM21PG221SN1D; Case: 0805; Mounted: Yes; Socket: No; SMD: Yes; ComponentHeight: 1.05mm; HelpURL: \\cern.ch\dfs\Applications\Altium\Datasheets\IND0402_MURATA_BLM21P.pdf; Author: CERN DEM JLC; CreateDate: 2010-01-25; LatestRevisionDate: 2010-01-25
J1 = TYCO_5-6605308-1: 1 Port, Yellow/Green LEDs, RJ45 10/100Base-T Ethernet, Mag45 Connector Module With Integrated Magnetics; Manufacturer: TYCO ELECTRONICS; PressFit: No; Part Number: TYCO_5-6605308-1; Component Kind: Standard; Component Type: Standard; Pin Count: 14; Family: RJ45; Mounted: Yes; Socket: No; SMD: No; Sense: No; Status: None; Part Description: 1 Port, Yellow/Green LEDs, RJ45 10/100Base-T Ethernet, Mag45 Connector Module With Integrated Magnetics; Manufacturer Part Number: 5-6605308-1; ComponentHeight: 15.24mm; HelpURL: \\cern.ch\dfs\Applications\Altium\Datasheets\TYCO_5-6605308-1.pdf; Author: CERN DEM JLC; CreateDate: 2012-08-23; LatestRevisionDate: 2012-08-23
Q1 = XTAL_25MHZ_EPSON_TSX-3225 25.0000MF10Z-AC: Crystal 4 pins 1=XTAL Control 2=GND3=XTAL 4=GND; Part Description: Tolerance ±10 ppm,  Stability:± 10ppm, -20°C to 75°C, 9pF, Surface Mount Quartz Crystal, TX-3225 Series; Manufacturer: EPSON; PressFit: No; Bonding: No; Part Number: XTAL_25MHZ_EPSON_TSX-3225 25.0000MF10Z-AC; Component Kind: Standard; Component Type: Standard; PackageDescription: Crystal TSX-3225 Serie, Corner Concave; 4 pin, 2.50mm L X 3.2mm W X 0.6mm H; Value: 25MHz; Manufacturer Part Number: TSX-3225 25.0000MF10Z-AC; Pin Count: 4; Mounted: Yes; Socket: No; SMD: Yes; Sense: No; ComponentHeight: 0.6mm; HelpURL: \\cern.ch\dfs\Applications\Altium\Datasheets\XTAL_EPSON_TSX-3225.pdf; ComponentLink1URL: \\cern.ch\dfs\Applications\Altium\Datasheets\XTAL_EPSON_TSX-3225_Ordering-Informations.pdf; ComponentLink1Description: Ordering Informations; Author: CERN DEM JLC; CreateDate: 2012-04-03; LatestRevisionDate: 2016-10-06
R1-R4 = R0402_49R9_0.1%_0.063W_25PPM: Resistor - 0.1%; Part Description: Thin Film Precision Resistor; Manufacturer: GENERIC; Manufacturer1 Part Number: CPF0402B49R9E1; Power: 0.063W; TC: ±25ppm/°C; Part Number: R0402_49R9_0.1%_0.063W_25PPM; Component Kind: Standard; Component Type: Standard; Pin Count: 2; Value: 49R9; Status: Not Recommended; Tolerance: ±0.1%; Manufacturer Part Number: R0402_49R9_0.1%_0.063W_25PPM; Case: 0402; Mounted: Yes; Sense: No; Socket: No; SMD: Yes; Manufacturer1 Example: TE CONNECTIVITY; Manufacturer1 ComponentHeight: 0.35mm; HelpURL: \\cern.ch\dfs\Applications\Altium\Datasheets\R0402_TYCO_CPF.pdf; Author: CERN DEM JMW; CreateDate: 2015-09-22; LatestRevisionDate: 2015-09-22
R5 = R0402_1K5_1%_0.0625W_100PPM: Resistor - 1%; Part Description: General Purpose Thick Film Chip Resistor; Manufacturer: GENERIC; Manufacturer1 Part Number: 232270671502L; TC: ±100ppm/°C; Part Number: R0402_1K5_1%_0.0625W_100PPM; Component Kind: Standard; Component Type: Standard; Pin Count: 2; Value: 1k5; Status: Not recommended; Power: 0.0625W; Tolerance: ±1%; Manufacturer Part Number: R0402_1K5_1%_0.0625W_100PPM; Case: 0402; Mounted: Yes; Sense: No; Socket: No; SMD: Yes; Manufacturer1 Example: YAGEO PHYCOMP; Manufacturer1 ComponentHeight: 0.4mm; HelpURL: \\cern.ch\dfs\Applications\Altium\Datasheets\R0402_Phycomp_RC0402.pdf; Author: CERN DEM JLC; CreateDate: 2007-12-03; LatestRevisionDate: 2012-10-17
R6-R9 R14 = R0402_4K7_1%_0.0625W_100PPM: Resistor - 1%; Part Description: General Purpose Thick Film Chip Resistor; Manufacturer: GENERIC; Manufacturer1 Part Number: 232270674702L; TC: ±100ppm/°C; Part Number: R0402_4K7_1%_0.0625W_100PPM; Component Kind: Standard; Component Type: Standard; Pin Count: 2; Value: 4k7; Status: Not recommended; Power: 0.0625W; Tolerance: ±1%; Manufacturer Part Number: R0402_4K7_1%_0.0625W_100PPM; Case: 0402; Mounted: Yes; Sense: No; Socket: No; SMD: Yes; Manufacturer1 Example: YAGEO PHYCOMP; Manufacturer1 ComponentHeight: 0.4mm; HelpURL: \\cern.ch\dfs\Applications\Altium\Datasheets\R0402_Phycomp_RC0402.pdf; Author: CERN DEM JLC; CreateDate: 2007-12-03; LatestRevisionDate: 2012-10-17
R10 R11 R13 R97 = R0402_33R_1%_0.0625W_100PPM: Resistor - 1%; Part Description: General Purpose Thick Film Chip Resistor; Manufacturer: GENERIC; Manufacturer1 Part Number: 232270673309L; TC: ±100ppm/°C; Part Number: R0402_33R_1%_0.0625W_100PPM; Component Kind: Standard; Component Type: Standard; Pin Count: 2; Value: 33; Status: Not recommended; Power: 0.0625W; Tolerance: ±1%; Manufacturer Part Number: R0402_33R_1%_0.0625W_100PPM; Case: 0402; Mounted: Yes; Sense: No; Socket: No; SMD: Yes; Manufacturer1 Example: YAGEO PHYCOMP; Manufacturer1 ComponentHeight: 0.4mm; HelpURL: \\cern.ch\dfs\Applications\Altium\Datasheets\R0402_Phycomp_RC0402.pdf; Author: CERN DEM JLC; CreateDate: 2007-12-03; LatestRevisionDate: 2012-10-17
R12 = R0603_21K_0.1%_0.063W_10PPM: Resistor - 0.1%; Part Description: Thin Film Chip Resistor; Manufacturer: GENERIC; Manufacturer1 Part Number: RN73C1J21KBTDF; Power: 0.063W; TC: ±10ppm; Part Number: R0603_21K_0.1%_0.063W_10PPM; Component Kind: Standard; Component Type: Standard; Pin Count: 2; Value: 21k; Status: Not recommended; Tolerance: ±0.1%; Manufacturer Part Number: R0603_21K_0.1%_0.063W_10PPM; Case: 0603; Mounted: Yes; Sense: No; Socket: No; SMD: Yes; Manufacturer1 Example: TYCO HOLSWORTHY; Manufacturer1 ComponentHeight: 0.5mm; HelpURL: \\cern.ch\dfs\Applications\Altium\Datasheets\R0603_Tyco_RN73.pdf; Author: CERN DEM JLC; CreateDate: 2007-12-03; LatestRevisionDate: 2008-03-13
U2 = LAN8742A-CZ-TR: LAN8742A-CZ-TR - Small Footprint RMII 10/100 Ethernet, Transceiver with HP Auto-MDIX and flexPWR Technology SQFN-24; Manuf_1: MICROCHIP; Order: LAN8742A-CZ-TR; Manuf_Part_1: LAN8742A-CZ-TR; Distrib: MICROCHIP

## Sheet PERIPH.SchDoc
size A4
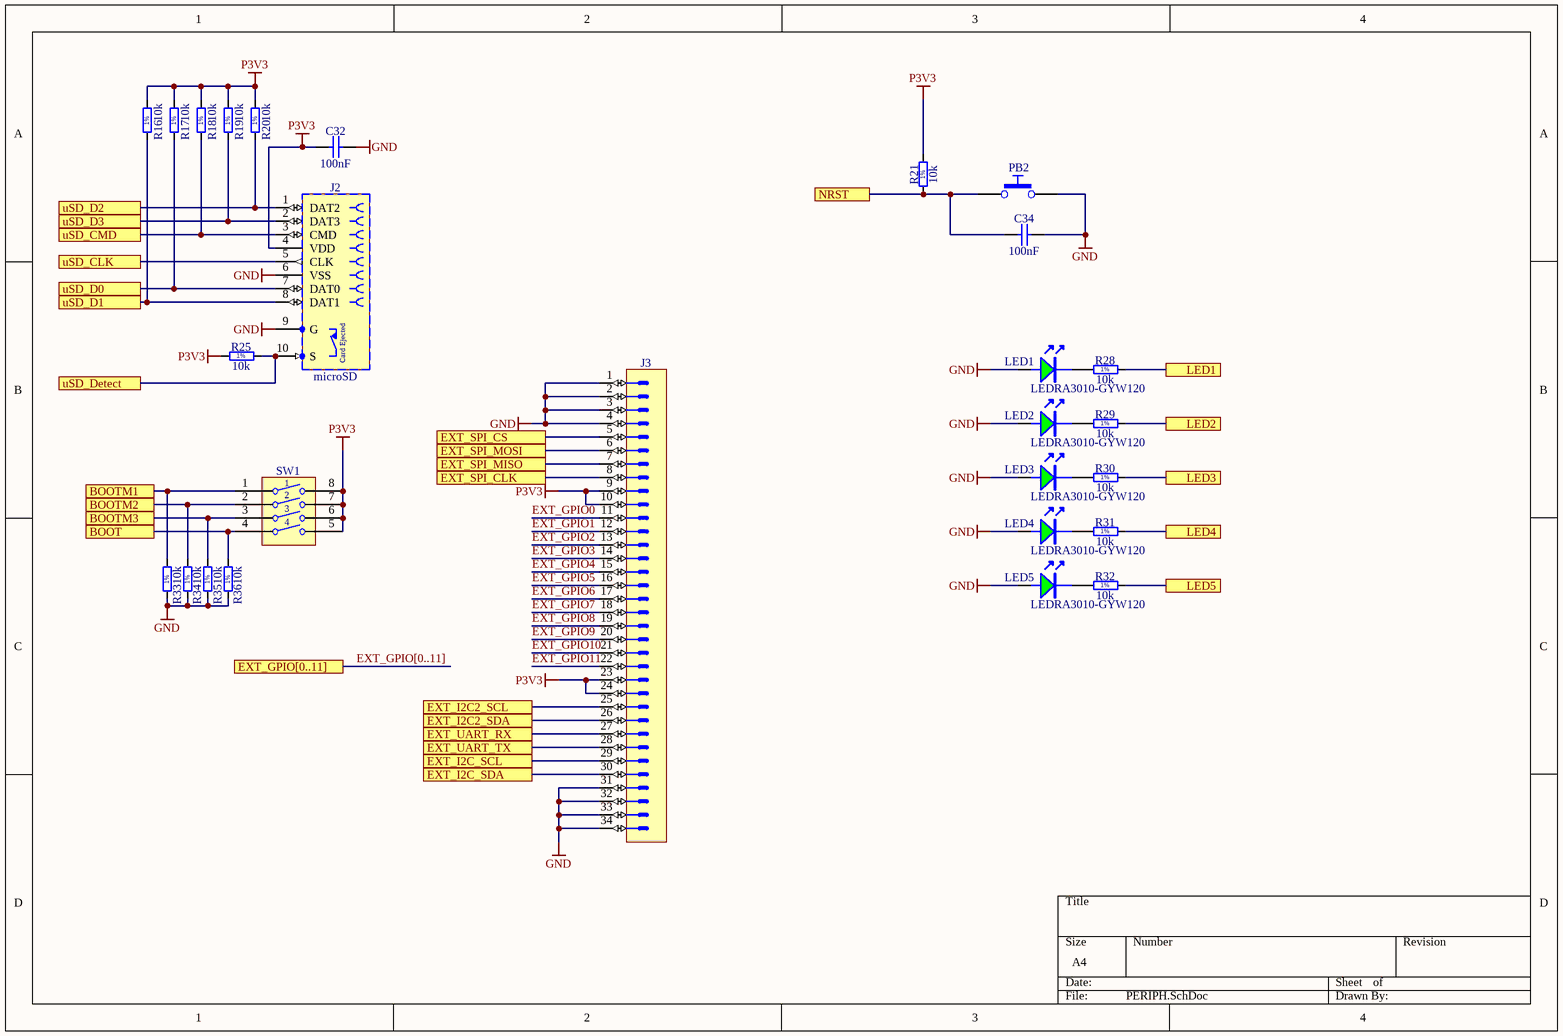
[diagram p3: PERIPH.SchDoc]

### Parts
(Parts that share a designator on the sheet are numbered #1, #2 ... from top to bottom, then left to right.)
C32  100nF  [CAPC1005X55N]
C34  100nF  [CAPC1005X55N]
J2  microSD  [ATTEND_112A-TAAR-R03]
J3  Header 34  [3M_N2534-6002RB]  (value not drawn)
LED1  LEDRA3010-GYW120  [LED_KPA3010_G]
LED2  LEDRA3010-GYW120  [LED_KPA3010_G]
LED3  LEDRA3010-GYW120  [LED_KPA3010_G]
LED4  LEDRA3010-GYW120  [LED_KPA3010_G]
LED5  LEDRA3010-GYW120  [LED_KPA3010_G]
PB2  Push Button  [PB_TYCO_FSMSM]  (value not drawn)
R16  10k  [RESC1005X40N]
R17  10k  [RESC1005X40N]
R18  10k  [RESC1005X40N]
R19  10k  [RESC1005X40N]
R20  10k  [RESC1005X40N]
R21#1  10k  [RESC1005X40N]
R25#1  10k  [RESC1005X40N]
R28  10k  [RESC1005X40N]
R29  10k  [RESC1005X40N]
R30  10k  [RESC1005X40N]
R31  10k  [RESC1005X40N]
R32  10k  [RESC1005X40N]
R33  10k  [RESC1005X40N]
R34  10k  [RESC1005X40N]
R35  10k  [RESC1005X40N]
R36  10k  [RESC1005X40N]
SW1  Switch  [SW_CTS_219-4MST]  (value not drawn)

### Ports
BOOT, BOOTM1, BOOTM2, BOOTM3, EXT_GPIO[0..11], EXT_I2C2_SCL, EXT_I2C2_SDA, EXT_I2C_SCL, EXT_I2C_SDA, EXT_SPI_CLK, EXT_SPI_CS, EXT_SPI_MISO, EXT_SPI_MOSI, EXT_UART_RX, EXT_UART_TX, LED1, LED2, LED3, LED4, LED5, NRST, uSD_CLK, uSD_CMD, uSD_D0, uSD_D1, uSD_D2, uSD_D3, uSD_Detect

### Nets
GND: C32.2 C34.2 J2.6(VSS) J2.9(G) J3.1 J3.2 J3.3 J3.4 J3.31 J3.32 J3.33 J3.34 LED1.A LED2.A LED3.A LED4.A LED5.A PB2.2 R33.1 R34.1 R35.1 R36.1
P3V3: C32.1 J2.4(VDD) J3.9 J3.10 J3.23 J3.24 R16.2 R17.2 R18.2 R19.2 R20.2 R21#1.2 R25#1.2 SW1.5 SW1.6 SW1.7 SW1.8
BOOT: R36.2 SW1.4 ; port BOOT
BOOT_SW1: R33.2 SW1.1 ; port BOOTM1
BOOT_SW2: R34.2 SW1.2 ; port BOOTM2
BOOT_SW3: R35.2 SW1.3 ; port BOOTM3
EXT_GPIO0: J3.11
EXT_GPIO1: J3.12
EXT_GPIO2: J3.13
EXT_GPIO3: J3.14
EXT_GPIO4: J3.15
EXT_GPIO5: J3.16
EXT_GPIO6: J3.17
EXT_GPIO7: J3.18
EXT_GPIO8: J3.19
EXT_GPIO9: J3.20
EXT_GPIO10: J3.21
EXT_GPIO11: J3.22
I2C2_SCL: J3.29 ; port EXT_I2C_SCL
I2C2_SDA: J3.30 ; port EXT_I2C_SDA
I2C3_SCL: J3.25 ; port EXT_I2C2_SCL
I2C3_SDA: J3.26 ; port EXT_I2C2_SDA
LED1: R28.2 ; port LED1
LED2: R29.2 ; port LED2
LED3: R30.2 ; port LED3
LED4: R31.2 ; port LED4
LED5: R32.2 ; port LED5
RST: C34.1 PB2.1 R21#1.1 ; port NRST
SDIO_CLK: J2.5(CLK) ; port uSD_CLK
SDIO_CMD: J2.3(CMD) R18.1 ; port uSD_CMD
SDIO_D0: J2.7(DAT0) R17.1 ; port uSD_D0
SDIO_D1: J2.8(DAT1) R16.1 ; port uSD_D1
SDIO_D2: J2.1(DAT2) R20.1 ; port uSD_D2
SDIO_D3: J2.2(DAT3) R19.1 ; port uSD_D3
SDIO_DET: J2.10(S) R25#1.1 ; port uSD_Detect
SPI5_MISO: J3.7 ; port EXT_SPI_MISO
SPI5_MOSI: J3.6 ; port EXT_SPI_MOSI
SPI5_NSS: J3.5 ; port EXT_SPI_CS
SPI5_SCK: J3.8 ; port EXT_SPI_CLK
USART2_RX: J3.27 ; port EXT_UART_RX
USART2_TX: J3.28 ; port EXT_UART_TX
NetLED1_K: LED1.K R28.1
NetLED2_K: LED2.K R29.1
NetLED3_K: LED3.K R30.1
NetLED4_K: LED4.K R31.1
NetLED5_K: LED5.K R32.1

### Buses and harness runs
bus EXT_GPIO[0..11] = port EXT_GPIO[0..11]

### Notes on the sheet
- (in symbol ATTEND_112A-TAAR-R03) Card Ejected
- (in symbol R0402_10K_1%_0.0625W_100PPM) 1%

### Library data of the parts
C32 C34 = CC0402_100NF_16V_10%_X5R: as C1 on sheet CPU; Part Number: CC0402_100NF_16V_10%_X5R; Component Kind: Standard; Component Type: Standard; Pin Count: 2; Value: 100nF; Status: None; Manufacturer Part Number: CC0402_100NF_16V_10%_X5R; Case: 0402; Mounted: Yes; Socket: No; SMD: Yes; Sense: No; Manufacturer1 Example: MURATA; Manufacturer1 ComponentHeight: 0.55mm; HelpURL: \\cern.ch\dfs\Applications\Altium\Datasheets\CC0402_X5R_MURATA_GRM.pdf; Author: CERN DEM JLC; CreateDate: 2013-12-10; LatestRevisionDate: 2013-12-10
J2 = ATTEND_112A-TAAR-R03: Connector MicroSD 8 Pin + Switch; Part Description: MicroSD Socket, Push-Push Type; Manufacturer: ATTEND; PressFit: No; Part Number: ATTEND_112A-TAAR-R03; Component Kind: Standard; Component Type: Standard; Pin Count: 10; Family: microSD; Mounted: Yes; Socket: No; SMD: Yes; Sense: No; Status: None; Manufacturer Part Number: 112A-TAAR-R03; ComponentHeight: 1.9mm; HelpURL: \\cern.ch\dfs\Applications\Altium\Datasheets\ATTEND_112A-TAAR-R03.pdf; Author: CERN DEM JMW; CreateDate: 2015-07-07; LatestRevisionDate: 2015-07-07
J3 = 3M_N2534-6002RB: Connector 34 Male; Part Description: 34 Contacts - Straight .100'' x .100'' Low Profile Four-Wall Header, 2500 Series; Manufacturer: 3M; PressFit: No; Part Number: 3M_N2534-6002RB; Component Kind: Standard; Component Type: Standard; Pin Count: 34; Family: Header 34; Mounted: Yes; Socket: No; SMD: No; Sense: No; Status: None; Manufacturer Part Number: N2534-6002RB; ComponentHeight: 10.03mm; HelpURL: \\cern.ch\dfs\Applications\Altium\Datasheets\3M_N2534-6002RB.pdf; Author: CERN DEM JLC; CreateDate: 2009-02-11; LatestRevisionDate: 2009-08-11
LED1-LED5 = LED_SMD_90deg_G: LED (Maritex); Supplier 1: Farnell; Supplier Part Number 1: 8530335RL
PB2 = PB_TYCO_FSMSM: Push-Button Switch SPDT; Part Description: 12VDC 50mA SPST Tactile  Push-Button Switch; Manufacturer: TYCO ELECTRONICS; Manufacturer Part Number: FSMSM or 1437566-3; PressFit: No; Part Number: PB_TYCO_FSMSM; Component Kind: Standard; Component Type: Standard; Pin Count: 2; PackageDescription: Body 3.5x6.0mm, Pushbutton Switch,  TYCO ALCOSWITCH FSMSM Serie; Family: Push Button; Mounted: Yes; Socket: No; SMD: Yes; Sense: No; Status: None; ComponentHeight: 4.3mm; HelpURL: \\cern.ch\dfs\Applications\Altium\Datasheets\PB_TYCO_FSMSM.pdf; Author: CERN DEM JLC; CreateDate: 30.06.2008; LatestRevisionDate: 21.06.2012
R16-R20 R21#1 R25#1 R28-R36 = R0402_10K_1%_0.0625W_100PPM: as R47 on sheet CPU; Part Number: R0402_10K_1%_0.0625W_100PPM; Component Kind: Standard; Component Type: Standard; Pin Count: 2; Value: 10k; Status: Not recommended; Power: 0.0625W; Tolerance: ±1%; Manufacturer Part Number: R0402_10K_1%_0.0625W_100PPM; Case: 0402; Mounted: Yes; Sense: No; Socket: No; SMD: Yes; Manufacturer1 Example: YAGEO PHYCOMP; Manufacturer1 ComponentHeight: 0.4mm; HelpURL: \\cern.ch\dfs\Applications\Altium\Datasheets\R0402_Phycomp_RC0402.pdf; Author: CERN DEM JLC; CreateDate: 2007-12-03; LatestRevisionDate: 2012-10-17
SW1 = SW_CTS_219-4MST: 4 Ways SPST DIP Switch; Part Description: 4 Ways, Pitch 2.54mm, SPST DIP Switch, Rating 100mA 50VDC; Manufacturer: CTS ELECTROCOMPONENTS; PressFit: No; Part Number: SW_CTS_219-4MST; Component Kind: Standard; Component Type: Standard; Pin Count: 8; PackageDescription: Pitch 2.54mm, Body 6.7 x 11.63mm, 4 Ways SPST Surface-Mounting DIP Switch, CTS 219 Series; Family: Switch; Mounted: Yes; Socket: No; SMD: Yes; Sense: No; Status: None; Manufacturer Part Number: 219-4MST; ComponentHeight: 2.23mm; HelpURL: \\cern.ch\dfs\Applications\Altium\Datasheets\SW_CTS_219-4MST.pdf; Author: CERN DEM JLC; CreateDate: 2014-11-17; LatestRevisionDate: 2014-11-17